# EasyEDA Pro project balanceladder_2026-06-09.epro

# Schematic Schematic1
Board Name: Board1; Create Date: 2026-06-08; Page Name: P1; Project Name: balance ladder; Schematic Name: Schematic1; Update Date: 2026-06-08; Company: 嘉立创EDA; Page Size: A4; Version: V1.0
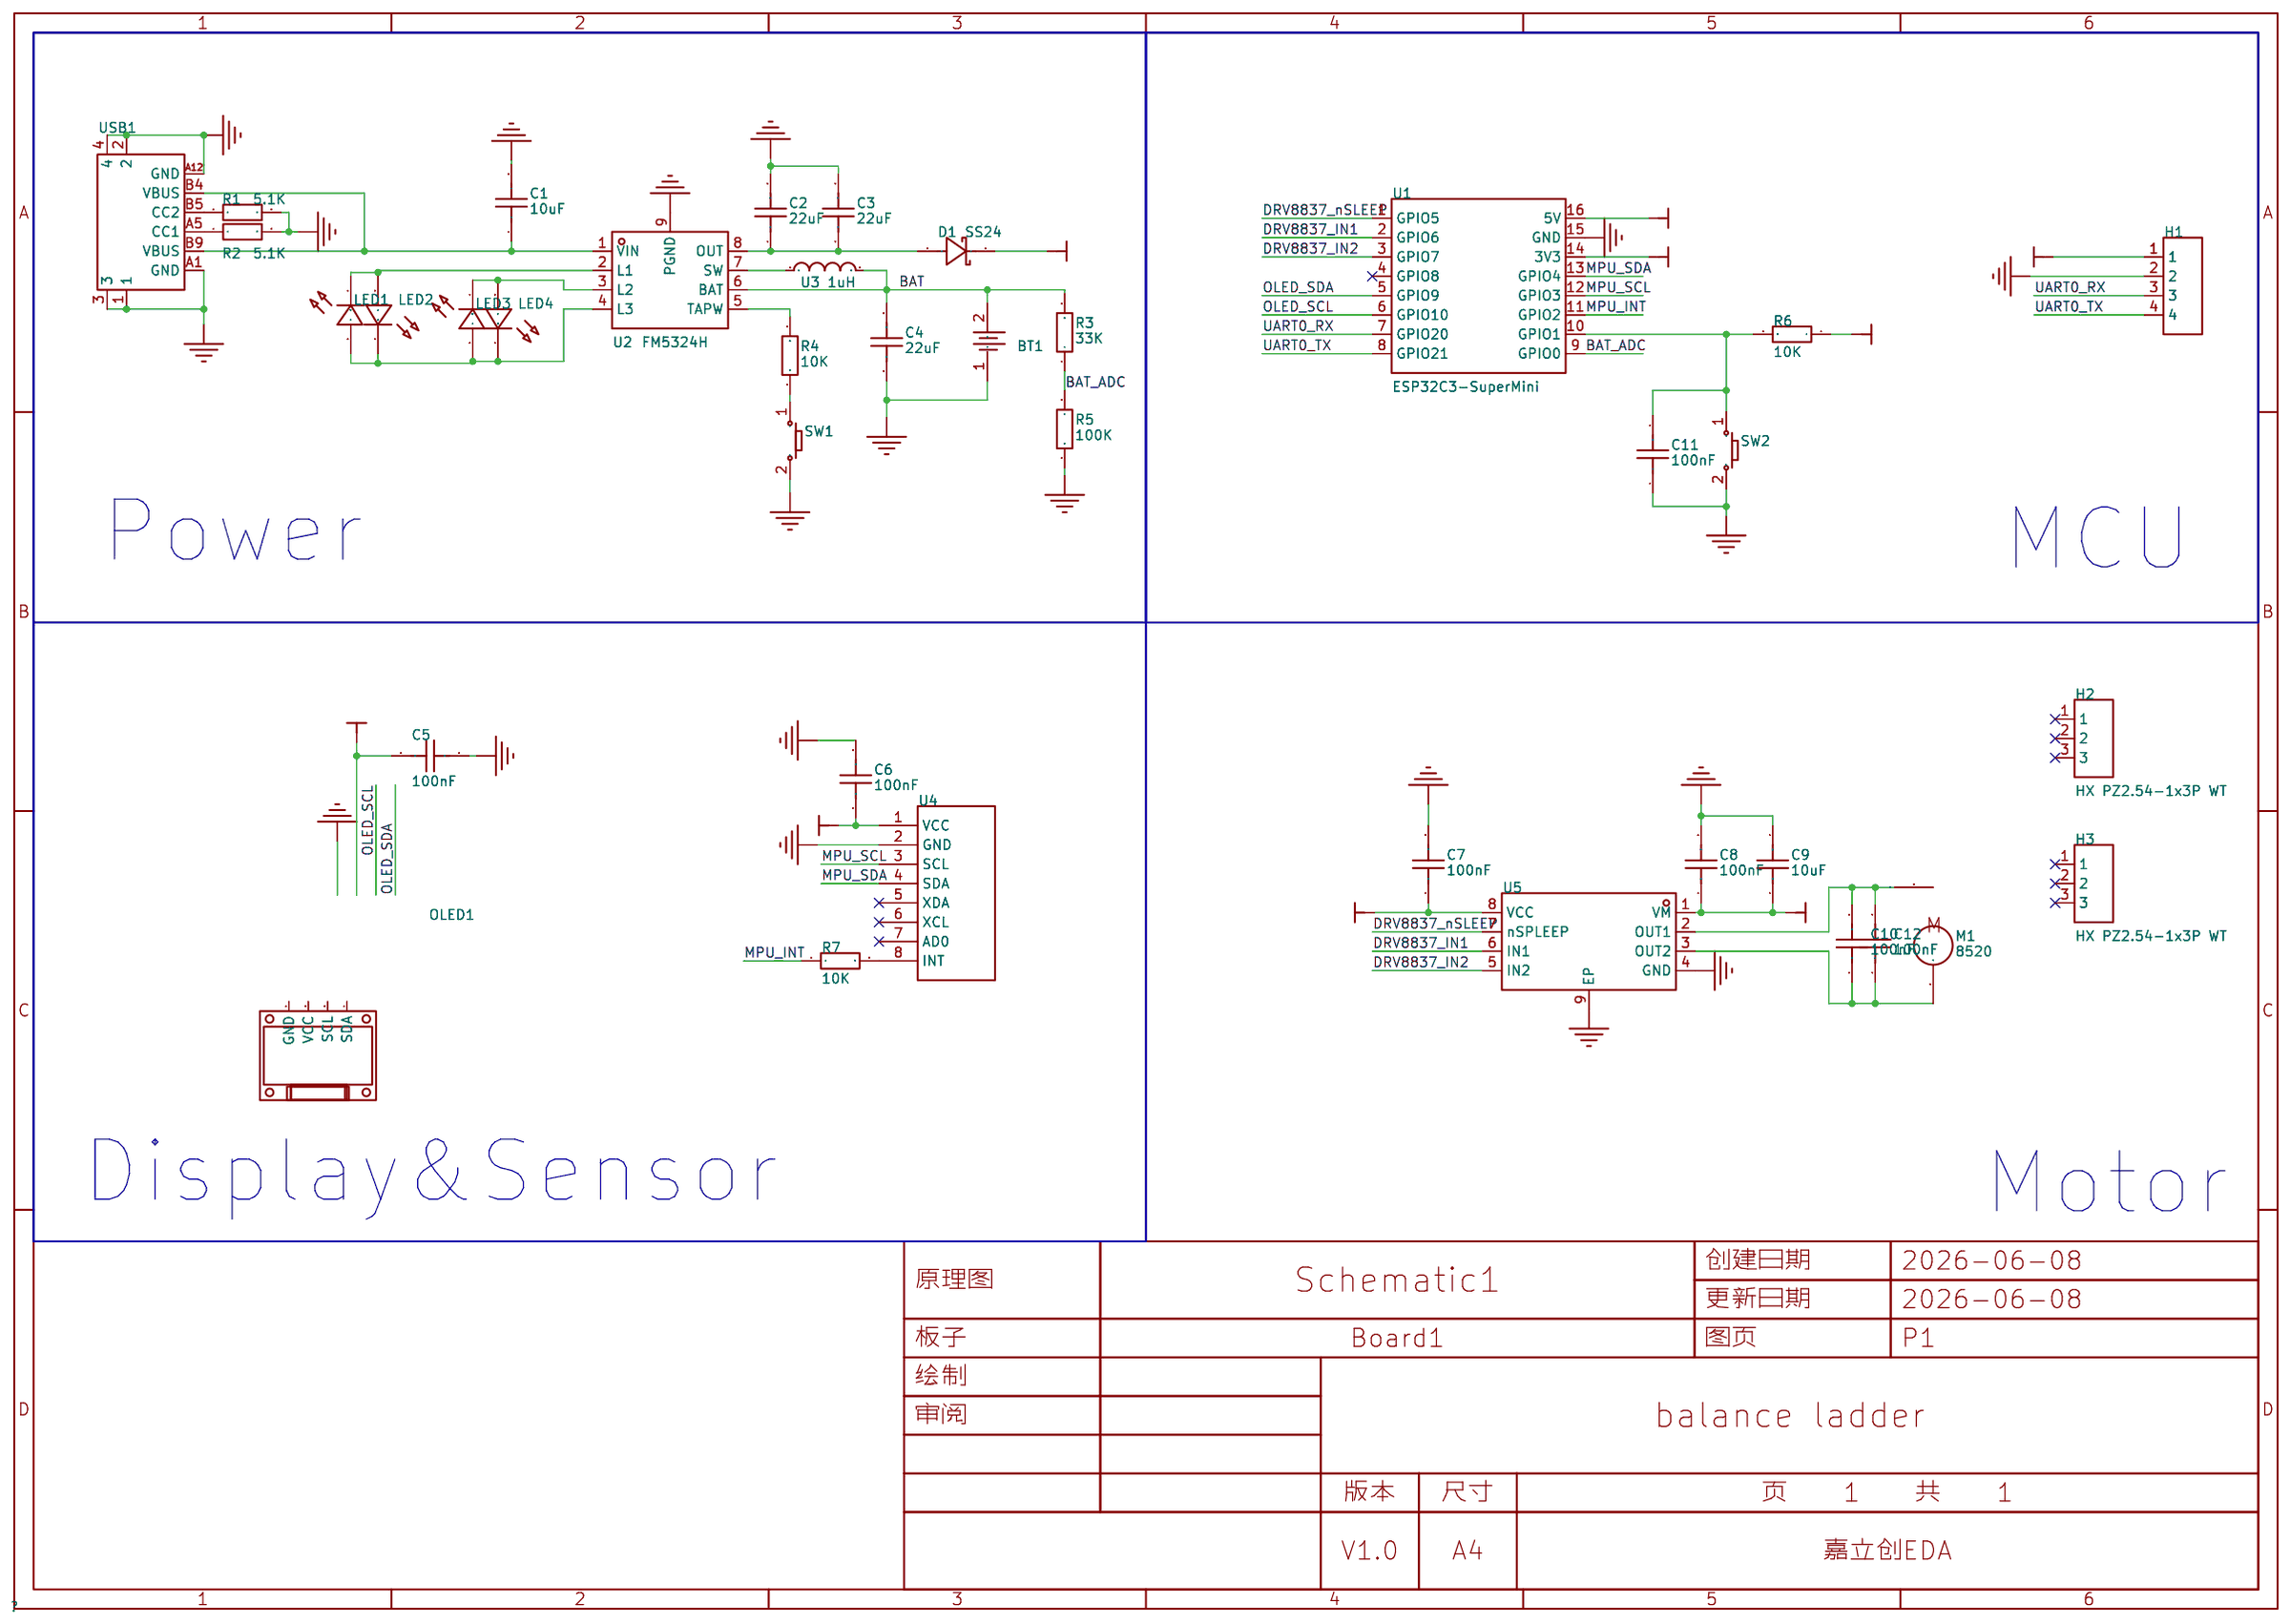
[diagram p0: schematic sheet]

## Parts
BT1  BH-18650-B1BA002  [BATTERY-SMD_18650-1S-L77.1-W20.7-1]
C1  10uF  [C0603]
C2  22uF  [C0603]
C3  22uF  [C0603]
C4  22uF  [C0603]
C5  100nF  [C0402]
C6  100nF  [C0402]
C7  100nF  [C0402]
C8  100nF  [C0402]
C9  10uF  [C0603]
C10  100nF  [C0402]
C11  100nF  [C0402]
C12  100nF  [C0402]
D1  SS24  [SMA_L4.3-W2.6-LS5.0-FD]
H1  HX PZ2.54-1x4P WT  [CONN-SMD_HX-PZ2.54-1X4P-WT]
H2  HX PZ2.54-1x3P WT  [HDR-SMD_3P-P2.54-H-M_KH-2.54PH-1X3P-L13.5-WT]
H3  HX PZ2.54-1x3P WT  [HDR-SMD_3P-P2.54-H-M_KH-2.54PH-1X3P-L13.5-WT]
LED1  -  [LED_0603]
LED2  -  [LED_0603]
LED3  -  [LED_0603]
LED4  -  [LED_0603]
M1  8520  [8520]
OLED1  -  [0.96OLED_4P]
R1  5.1K  [R0603]
R2  5.1K  [R0603]
R3  33K  [R0603]
R4  10K  [R0603]
R5  100K  [R0603]
R6  10K  [R0603]
R7  10K  [R0402]
SW1  -  [Key_SMD_3x4x2]
SW2  -  [Key_SMD_3x4x2]
U1  ESP32C3-SuperMini  [COMM-SMD_16P-L22.5-W18.0-P2.54-TL]
U2  FM5324H  [ESOP-8_L4.9-W3.9-P1.27-LS6.0-BL-EP3.1]
U3  1uH  [IND-SMD_L2.5-W2.0-VLS252012CX-150M]
U4  -  [GY521]
U5  DRV8837DSGR  [WSON-8_L2.0-W2.0-P0.50-TL-EP]
USB1  HYCW574-USBC06-650B  [USB-C-SMD_HYCW574-USBC06-650B]

## Library data of the parts
BT1 = BH-18650-B1BA002: BHAu SMT/适用电池18650平头电芯//电池底座/ 卧式自动化生产贴片电池盒/符合耐高温SMT回流焊工艺/材质：PA46/SUS304 T=0.35mm/镀金/; LCSC Part Name: MYOUNG(美阳)电池盒 BHAu 适用电池18650平头电芯、电池底座、卧式自动化生产贴片电池盒、SMT 180° TYPE; Supplier Part: C2988620; Manufacturer: MYOUNG(美阳); JLCPCB Part Class: 扩展库; Datasheet: https://item.szlcsc.com/datasheet/BH-18650-B1BA002/3446919.html; Supplier: LCSC; Type: 电池盒; Operating Temperature: -25~85℃; Contact material: 磷青铜; Contact coating: 镀金; Applicable battery specifications: 18650
C1-C4 C9 = CAP_0603: Supplier Footprint: 0603
C5-C8 C10-C12 = CL05B104KO5NNNC: 容值:100nF;精度:±10%;额定电压:16V;温度系数:X7R;; LCSC Part Name: 100nF ±10% 16V; Supplier Part: C1525; Manufacturer: SAMSUNG(三星); Supplier Footprint: 0402; JLCPCB Part Class: Basic Part; Datasheet: https://item.szlcsc.com/datasheet/CL05B104KO5NNNC/1877.html; Supplier: LCSC; Tolerance: ±10%; Voltage Rating: 16V; Temperature Coefficient: X7R
D1 = SS24_C7420362: 二极管配置:独立式;正向压降(Vf):550mV@2A;直流反向耐压(Vr):40V;整流电流:2A;; LCSC Part Name: 电压:40V 电流:2A; Supplier Part: C7420362; Manufacturer: R+O(宏嘉诚); Supplier Footprint: SMA(DO-214AC); JLCPCB Part Class: Extended Part; Datasheet: https://item.szlcsc.com/datasheet/SS24/8397184.html; Supplier: LCSC; Diode Configuration: 独立式; Voltage - Forward(Vf@If): 550mV@2A; Voltage - DC Reverse(Vr): 40V; Current - Rectified: 2A; Reverse Leakage Current (Ir): 200uA@40V; Operating Junction Temperature Range: -55℃~+150℃; Non-Repetitive Peak Forward Surge Current: 50A
H1 = HX PZ2.54-1x4P WT: 插针结构:1x4P;间距:2.54mm;行距:-;圆针/方针:方针;安装方式:卧贴;排数:单排;总PIN位数:4P;额定电流:3A;额定电压:1kV;配合针长度:6mm;塑高:2.5mm;端接针长度:-;触头材质:黄铜;触头镀层:金;工作温度:-40℃~+105℃;颜色:黑色;; LCSC Part Name: 配套排母：HX PM2.54-1x4P系列 1x4P 间距:2.54mm 方针 卧贴; Supplier Part: C46061677; Manufacturer: hanxia(韩下); Supplier Footprint: SMD,P=2.54mm,卧贴; JLCPCB Part Class: Extended Part; Datasheet: https://item.szlcsc.com/datasheet/HX%2520PZ2.54-1x4P%2520WT/48170537.html; Supplier: LCSC; Pin Structure: 1x4P; Pitch: 2.54mm; Circluar Pins/Square Pins: 方针; Mounting Type: 卧贴; Number of Rows: 单排; Number of Pins: 4P; Current Rating: 3A; Voltage Rating (Max): 1kV; Length of Mating Pin: 6mm; Insulation Height: 2.5mm; Contact Material: 黄铜; Contact Plating: 金; Operating Temperature: -40℃~+105℃; Color: 黑色
H2 H3 = HX PZ2.54-1x3P WT: 插针结构:1x3P;间距:2.54mm;行距:-;圆针/方针:方针;安装方式:卧贴;排数:单排;总PIN位数:3P;额定电流:3A;额定电压:1kV;配合针长度:6mm;塑高:2.5mm;端接针长度:-;触头材质:黄铜;触头镀层:金;工作温度:-40℃~+105℃;颜色:黑色;; LCSC Part Name: 配套排母：HX PM2.54-1x3P系列 1x3P 间距:2.54mm 方针 卧贴; Supplier Part: C46061676; Manufacturer: hanxia(韩下); Supplier Footprint: SMD,P=2.54mm,卧贴; JLCPCB Part Class: Extended Part; Datasheet: https://item.szlcsc.com/datasheet/HX%2520PZ2.54-1x3P%2520WT/48170536.html; Supplier: LCSC; Pin Structure: 1x3P; Pitch: 2.54mm; Circluar Pins/Square Pins: 方针; Mounting Type: 卧贴; Number of Rows: 单排; Number of Pins: 3P; Current Rating: 3A; Voltage Rating (Max): 1kV; Length of Mating Pin: 6mm; Insulation Height: 2.5mm; Contact Material: 黄铜; Contact Plating: 金; Operating Temperature: -40℃~+105℃; Color: 黑色
LED1-LED4 = LED_0603-G: Supplier Footprint: 0603
M1 = 8520: Published: 24-Mar-1999; LatestRevisionDate: 17-Jul-2002; LatestRevisionNote: Re-released for DXP Platform.; PackageReference: RB5-10.5; Publisher: Altium Limited; PackageDescription: Capacitor (Radial); 2 Leads
OLED1 = 0.96OLED模块_4P: Supplier Footprint: 插件
R1-R6 = Res_0603: Supplier Footprint: 0603
R7 = Res_0402: Supplier Footprint: 0402
SW1 SW2 = Key_SMD_3x4x2: Supplier Footprint: SMD
U1 = ESP32C3-SuperMini: Supplier Part: C9900147397; Supplier Footprint: SMD-16P; JLCPCB Part Class: Extended Part; Supplier: LCSC
U2 = FM5324H: LCSC Part Name: 停产; Supplier Part: C7420388; Manufacturer: FM(富满); Supplier Footprint: ESOP8L; JLCPCB Part Class: Extended Part; Supplier: LCSC
U3 = FTC252012S1R0MBCA: 电感值:1uH;精度:±20%;额定电流:4A;饱和电流(Isat):5.6A;类型:-;; LCSC Part Name: 1uH ±20% 5.6A; Supplier Part: C5832370; Manufacturer: cjiang(长江微电); Supplier Footprint: 1008; JLCPCB Part Class: Extended Part; Datasheet: https://item.szlcsc.com/datasheet/FTC252012S1R0MBCA/6763490.html; Supplier: LCSC; Tolerance: ±20%; Current Rating: 4A; Current - Saturation(Isat): 5.6A; DC Resistance(DCR): 35mΩ
U4 = GY521: MPU6050陀螺仪传感器模块
U5 = DRV8837DSGR: DRV8837 12V、1.8A H 桥电机驱动器; LCSC Part Name: 1.8A 有刷直流电机驱动芯片 7V; Supplier Part: C39159; Manufacturer: TI(德州仪器); Supplier Footprint: WSON-8-EP(2x2); JLCPCB Part Class: Extended Part; Datasheet: https://www.ti.com/cn/lit/gpn/drv8837; Supplier: LCSC; Technology: 是; Peak Current: 1.9A; Voltage - Supply: 1.8V~7V; RDS(on): 280mΩ; Quiescent Current(Iq): 120nA; Operating Temperature: -40℃~+85℃
USB1 = HYCW574-USBC06-650B: 连接器类型:Type-C;协议标准:USB 3.1;公母:母;安装方式:卧贴;触点数量:6P;端口数量:1;额定电流 - 电源:3A;工作温度:-25℃~+85℃;; LCSC Part Name: Type-C 母 卧贴; Supplier Part: C42400239; Manufacturer: HOAUC(华宇创); Supplier Footprint: SMD; JLCPCB Part Class: 扩展库; Datasheet: https://item.szlcsc.com/datasheet/HYCW574-USBC06-650B/44352772.html; Supplier: LCSC; Connector Type: Type-C; Protocol Standard: USB 3.1; Gender: 母; Mounting Type: 卧贴; Number of Contacts: 6P; Number of Ports: 1; Current Rating-Power: 3A; Connect-Disconnect Life: 5千次; Length: 6.5mm; Detection color: 黑色; Operating Temperature: -25℃~+85℃

## Nets
+5V: C8.1 C9.1 D1.2(K) U1.16(5V) U5.1(VM)
GND: BT1.1 C1.2 C2.2 C3.2 C4.1 C5.1 C6.2 C7.2 C8.2 C9.2 C11.1 H1.2 R1.2 R2.2 R5.1 SW1.2 SW2.2 U1.15(GND) U2.9(PGND) U4.2(GND) U5.4(GND) U5.9(EP) USB1.1 USB1.2 USB1.3 USB1.4 USB1.A1(GND) USB1.A12(GND)
VCC: C5.2 C6.1 C7.1 H1.1 R6.1 U1.14(3V3) U4.1(VCC) U5.8(VCC)
BAT: BT1.2 C4.2 R3.2 U2.6(BAT) U3.2
BAT_ADC: R3.1 R5.2 U1.9(GPIO0)
DRV8837_IN1: U1.2(GPIO6) U5.6(IN1)
DRV8837_IN2: U1.3(GPIO7) U5.5(IN2)
DRV8837_nSLEEP: U1.1(GPIO5) U5.7(nSPLEEP)
MPU_INT: R7.1 U1.11(GPIO2)
MPU_SCL: U1.12(GPIO3) U4.3(SCL)
MPU_SDA: U1.13(GPIO4) U4.4(SDA)
OLED_SCL: U1.6(GPIO10)
OLED_SDA: U1.5(GPIO9)
UART0_RX: H1.3 U1.7(GPIO20)
UART0_TX: H1.4 U1.8(GPIO21)
$1N883: R4.2 U2.5(TAPW)
$1N886: U2.7(SW) U3.1
$1N887: C2.1 C3.1 D1.1(A) U2.8(OUT)
$1N1154: C10.2 C12.2 M1.2 U5.2(OUT1)
$1N1155: C10.1 C12.1 M1.1 U5.3(OUT2)
$1N1213: R7.2 U4.8(INT)
Net-(C1-1): C1.1 U2.1(VIN) USB1.B4(VBUS) USB1.B9(VBUS)
Net-(C11-2): C11.2 R6.2 SW2.1 U1.10(GPIO1)
Net-(LED1-1): LED1.1(C) LED2.2(A) U2.2(L1)
Net-(LED1-2): LED1.2(A) LED2.1(C) LED3.2(A) LED4.1(C) U2.4(L3)
Net-(LED3-1): LED3.1(C) LED4.2(A) U2.3(L2)
Net-(R1-1): R1.1 USB1.B5(CC2)
Net-(R2-1): R2.1 USB1.A5(CC1)
Net-(R4-1): R4.1 SW1.1

Not connected (* = marked no-connect by the designer): H2 1* 2* 3*; H3 1* 2* 3*; OLED1 1(GND) 2(VCC) 3(SCL) 4(SDA); U1 4(GPIO8)*; U4 5(XDA)* 6(XCL)* 7(AD0)*

## Notes on the sheet
- Power
- MCU
- Display&Sensor
- Motor

# Board PCB1
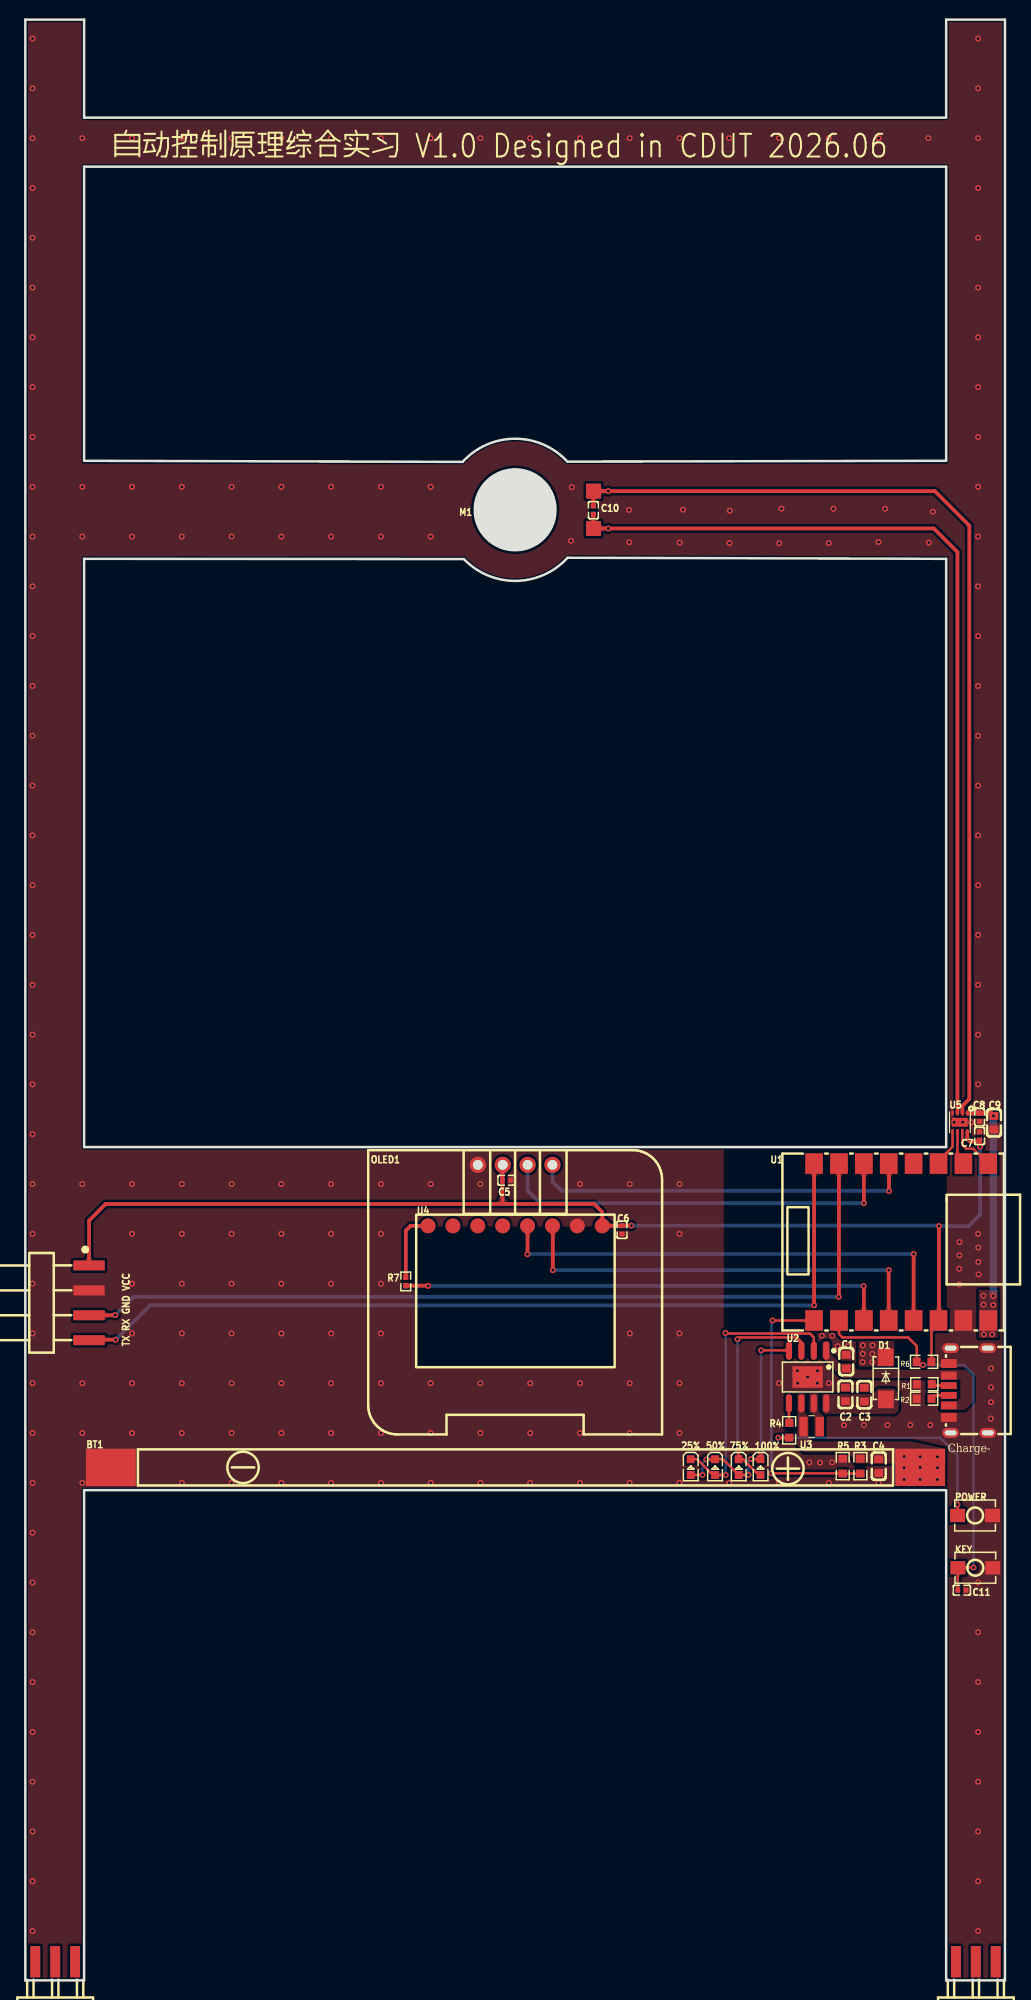
[diagram p1: board, top side]
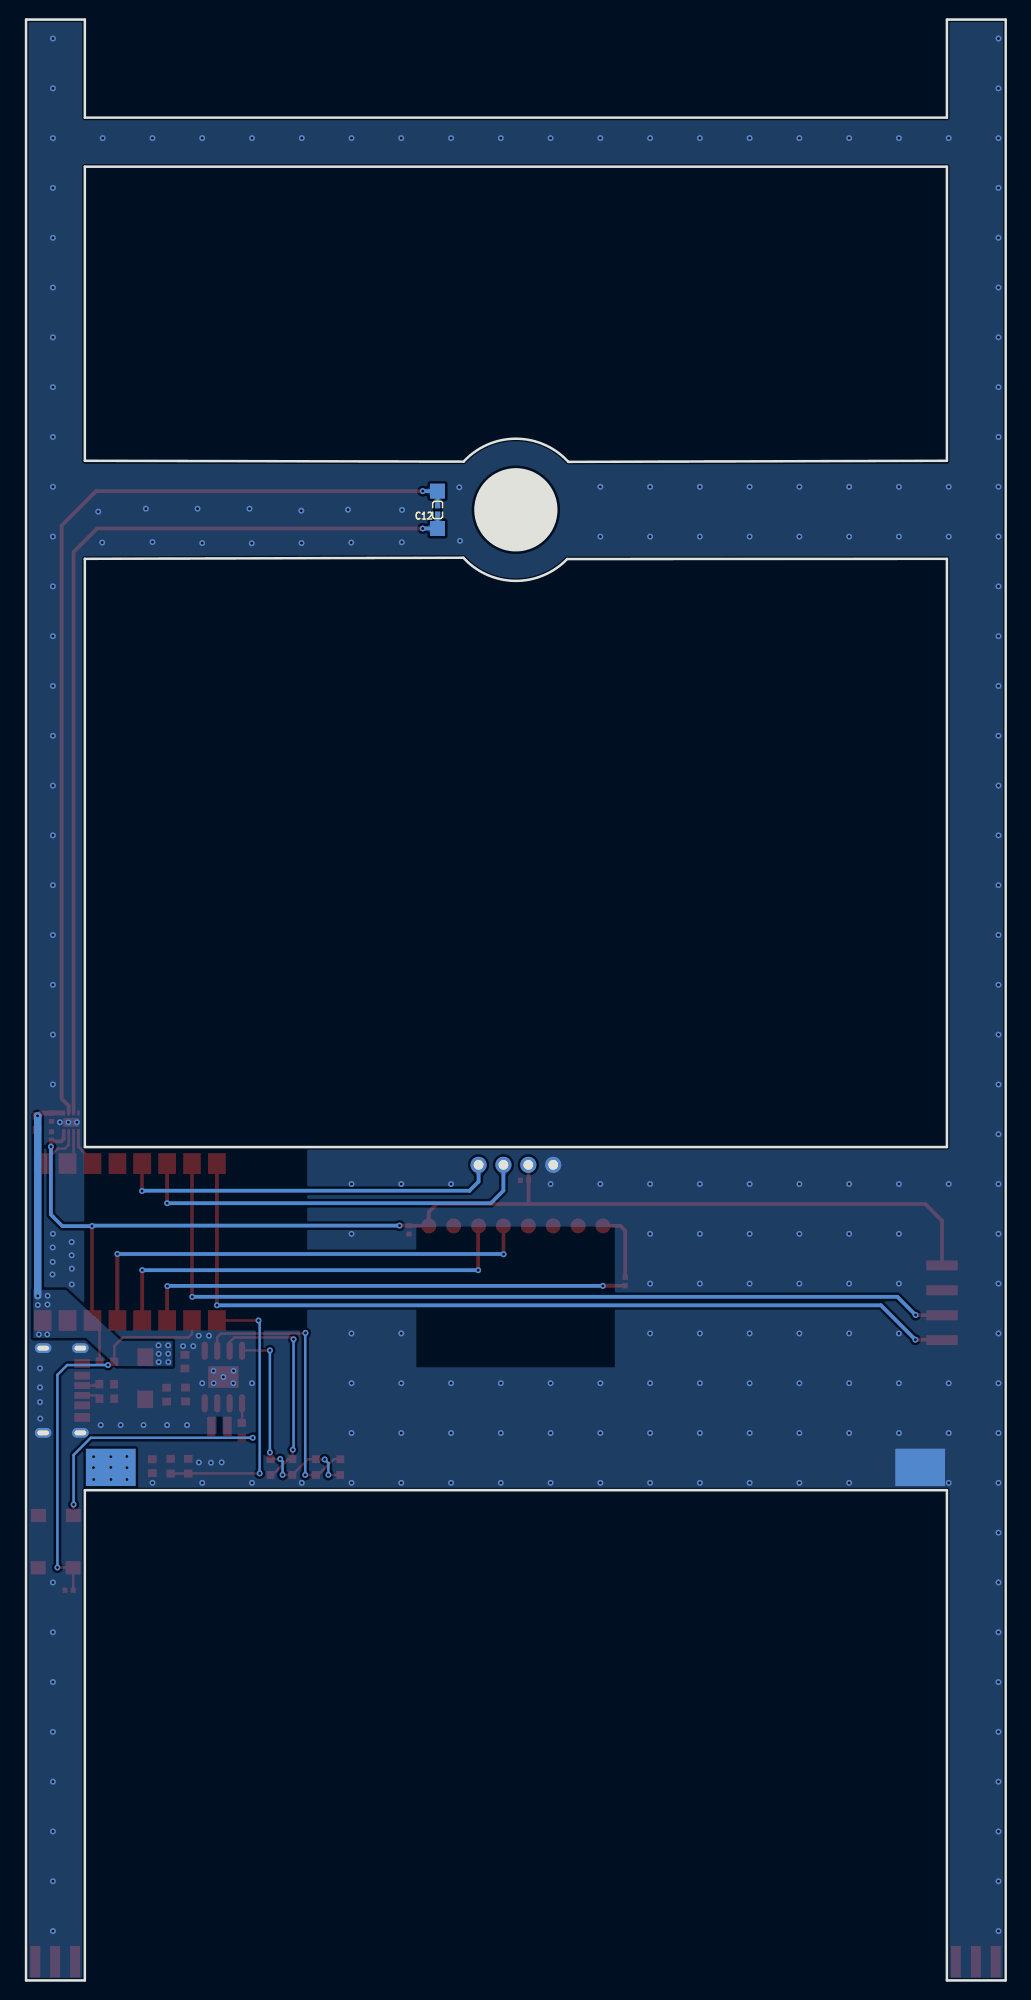
[diagram p2: board, bottom side, seen from below]

Outline 100 x 200 mm; copper layers: Top Layer, Bottom Layer. Coordinates in mm from the lower left corner of the outline.
Outline path: 0,200 0,0 6,0 6,50 94,50 94,0 100,0 100,200 94,200 94,190 6,190 6,200 0,200 ; 6,185 6,155 44.65,154.89 arc(49.98,157.25) 55.33,154.91 94,155 94,185 6,185 ; 6,145 6,85 94,85 94,145 55.35,145.11 arc(50.09,142.75) 44.77,144.98 6,145
Stack: Top Layer 0.035mm / Dielectric1 1.51mm FR4 er 4.5 / Bottom Layer 0.035mm

## Design rules (mm)
spacing copperThickness1oz (default): track to track 0.102, other pairs 0 to 0.3
spacing copperThickness2oz: track to track 0.203, other pairs 0.152 to 0.3
track width copperThickness1oz (default): min 0.127, default 0.254, max 2.54
track width copperThickness2oz: min 0.203, default 0.254, max 2.54
differential pair differentialPair (default): width min 0.127, default 0.254, max 2.54; gap min 0.152, default 0.152
net GND uses copperRegion_copperThickness1oz
pour e400 uses copperRegion_copperThickness2oz, copperThickness2oz

## Placement (name value [footprint] x y rotation side)
25%  -  [LED_0603]  67.93 52.31 270 top
50%  -  [LED_0603]  70.41 52.31 270 top
75%  -  [LED_0603]  72.83 52.31 270 top
100%  -  [LED_0603]  75.06 52.31 270 top
BT1  BH-18650-B1BA002  [BATTERY-SMD_18650-1S-L77.1-W20.7-1]  50.04 54.1 270 top
C1  10uF  [C0603]  83.79 63.12 90 top
C2  22uF  [C0603]  83.72 59.77 90 top
C3  22uF  [C0603]  85.65 59.74 90 top
C4  22uF  [C0603]  87.12 52.45 90 top
C5  100nF  [C0402]  49.12 81.61 180 top
C6  100nF  [C0402]  60.91 76.56 270 top
C7  100nF  [C0402]  97.41 86.13 90 top
C8  100nF  [C0402]  97.41 88.04 270 top
C9  10uF  [C0603]  98.88 87.48 270 top
C10  100nF  [C0402]  57.99 149.96 90 top
C11  100nF  [C0402]  95.61 39.8 180 top
C12  100nF  [C0402]  57.99 149.99 90 bottom
Charge-  HYCW574-USBC06-650B  [USB-C-SMD_HYCW574-USBC06-650B]  96.27 60.17 90 top
D1  SS24  [SMA_L4.3-W2.6-LS5.0-FD]  87.83 61.42 90 top
H2  HX PZ2.54-1x3P WT  [HDR-SMD_3P-P2.54-H-M_KH-2.54PH-1X3P-L13.5-WT]  3.05 1.91 0 top
H3  HX PZ2.54-1x3P WT  [HDR-SMD_3P-P2.54-H-M_KH-2.54PH-1X3P-L13.5-WT]  97.03 1.91 0 top
KEY  -  [Key_SMD_3x4x2]  96.98 42.09 0 top
M1  -  [8520]  50 150 90 top
OLED1  -  [0.96OLED_4P]  50 83.19 0 top
POWER  -  [Key_SMD_3x4x2]  96.95 47.42 0 top
R1  5.1K  [R0603]  91.77 60.81 180 top
R2  5.1K  [R0603]  91.75 59.33 180 top
R3  33K  [R0603]  85.24 52.45 90 top
R4  10K  [R0603]  77.98 56.11 90 top
R5  100K  [R0603]  83.44 52.45 270 top
R6  10K  [R0603]  91.75 63.09 180 top
R7  10K  [R0402]  38.84 71.3 90 top
TX RX GND VCC  HX PZ2.54-1x4P WT  [CONN-SMD_HX-PZ2.54-1X4P-WT]  6.5 69.11 270 top
U1  ESP32C3-SuperMini  [COMM-SMD_16P-L22.5-W18.0-P2.54-TL]  89.41 75.31 270 top
U2  FM5324H  [ESOP-8_L4.9-W3.9-P1.27-LS6.0-BL-EP3.1]  79.86 61.54 180 top
U3  1uH  [IND-SMD_L2.5-W2.0-VLS252012CX-150M]  80.26 56.49 180 top
U4  -  [GY521]  50 69.98 270 top
U5  DRV8837DSGR  [WSON-8_L2.0-W2.0-P0.50-TL-EP]  95.4 87.53 270 top

## Footprints (pads in the part's own frame, mm; a bottom-side part is the same pattern mirrored in y, then rotated)
0.96OLED_4P
  round 1.65 hole 1: 1(-3.81,-0.002) 2(-1.27,0.002) 3(1.27,0.002) 4(3.81,0.002)
8520
  rect 1.524x1.524 smd: 1(-1.905,-8.001) 2(1.905,-8.001)
  rect 1.524x1.524 smd far side: 1(-1.905,-8.001) 2(1.905,-8.001)
BATTERY-SMD_18650-1S-L77.1-W20.7-1
  rect 3.8x5.08 smd: 1(1.778,-41.313) 2(1.778,41.313)
  rect 3.8x5.08 smd far side: 1(1.778,-41.313) 2(1.778,41.313)
C0402
  rect 0.5x0.54 smd: 1(-0.42,0) 2(0.42,0)
C0603
  rect 0.8x0.9 smd: 1(-0.7,0) 2(0.7,0)
COMM-SMD_16P-L22.5-W18.0-P2.54-TL
  rect 2.102x1.802 smd: 1(-8.001,8.89) 2(-8.001,6.35) 3(-8.001,3.81) 4(-8.001,1.27) 5(-8.001,-1.27) 6(-8.001,-3.81) 7(-8.001,-6.35) 8(-8.001,-8.89) 9(8.001,-8.89) 10(8.001,-6.35) 11(8.001,-3.81) 12(8.001,-1.27) 13(8.001,1.27) 14(8.001,3.81) 15(8.001,6.35) 16(8.001,8.89)
CONN-SMD_HX-PZ2.54-1X4P-WT
  rect 1.02x3.2 smd: 1(-3.81,0) 2(-1.27,0) 3(1.27,0) 4(3.81,0)
ESOP-8_L4.9-W3.9-P1.27-LS6.0-BL-EP3.1
  oval 0.63x1.865 smd: 1(-1.905,-2.683) 2(-0.635,-2.683) 3(0.635,-2.683) 4(1.905,-2.683) 5(1.905,2.683) 6(0.635,2.683) 7(-0.635,2.683) 8(-1.905,2.683)
  rect 3.1x2.2 smd: 9(0,0)
GY521
  round 1.524 smd: 1(-6.985,8.89) 2(-6.985,6.35) 3(-6.985,3.81) 4(-6.985,1.27) 5(-6.985,-1.27) 6(-6.985,-3.81) 7(-6.985,-6.35) 8(-6.985,-8.89)
HDR-SMD_3P-P2.54-H-M_KH-2.54PH-1X3P-L13.5-WT
  rect 1.02x3.2 smd: 1(-2.032,0) 2(0,0) 3(2.032,0)
IND-SMD_L2.5-W2.0-VLS252012CX-150M
  rect 0.85x2 smd: 1(-0.83,0) 2(0.83,0)
Key_SMD_3x4x2
  rect 1.53x1.36 smd: 1(-1.781,0) 2(1.781,0)
LED_0603
  rect 0.8x0.8 smd: 1(-0.851,-0.01) 2(0.75,-0.005)
R0402
  rect 0.566x0.54 smd: 1(-0.433,0) 2(0.433,0)
R0603
  rect 0.806x0.864 smd: 1(-0.753,0) 2(0.753,0)
SMA_L4.3-W2.6-LS5.0-FD
  rect 1.8x1.62 smd: 1(-2.15,-0.009) 2(2.15,0.009)
USB-C-SMD_HYCW574-USBC06-650B
  oval 1x1.7 hole 0.5x1.2: 1(-4.32,1.81) 2(4.32,1.81) 3(-4.32,-1.99) 4(4.32,-1.99)
  rect 0.9x1.6 smd: A1(-2.752,1.99) A12(2.748,1.99)
  rect 0.7x1.6 smd: A5(-0.502,1.99) B5(0.498,1.99)
  rect 0.8x1.6 smd: B4(1.518,1.99) B9(-1.522,1.99)
WSON-8_L2.0-W2.0-P0.50-TL-EP
  rect 0.521x0.25 smd: 1(-0.95,0.75) 2(-0.95,0.25) 3(-0.95,-0.25) 4(-0.95,-0.75) 5(0.95,-0.75) 6(0.95,-0.25) 7(0.95,0.25) 8(0.95,0.75)
  rect 0.9x1.6 smd: 9(0,0)

## Nets
+5V: C8.1 C9.1 D1.2 U1.16 U5.1
GND: BT1.1 C1.2 C2.2 C3.2 C4.1 C5.1 C6.2 C7.2 C8.2 C9.2 C11.1 Charge-.1 Charge-.2 Charge-.3 Charge-.4 Charge-.A1 Charge-.A12 KEY.2 OLED1.1 POWER.2 R1.2 R2.2 R5.1 TX RX GND VCC.2 U1.15 U2.9 U4.2 U5.4 U5.9
VCC: C5.2 C6.1 C7.1 OLED1.2 R6.1 TX RX GND VCC.1 U1.14 U4.1 U5.8
BAT: BT1.2 C4.2 R3.2 U2.6 U3.2
BAT_ADC: R3.1 R5.2 U1.9
DRV8837_IN1: U1.2 U5.6
DRV8837_IN2: U1.3 U5.5
DRV8837_nSLEEP: U1.1 U5.7
MPU_INT: R7.1 U1.11
MPU_SCL: U1.12 U4.3
MPU_SDA: U1.13 U4.4
OLED_SCL: OLED1.3 U1.6
OLED_SDA: OLED1.4 U1.5
UART0_RX: TX RX GND VCC.3 U1.7
UART0_TX: TX RX GND VCC.4 U1.8
$1N882: POWER.1 R4.1
$1N883: R4.2 U2.5
$1N886: U2.7 U3.1
$1N887: C2.1 C3.1 D1.1 U2.8
$1N889: C1.1 Charge-.B4 Charge-.B9 U2.1
$1N890: 75%.1 100%.2 U2.3
$1N893: 25%.2 50%.1 75%.2 100%.1 U2.4
$1N894: 25%.1 50%.2 U2.2
$1N1088: Charge-.B5 R1.1
$1N1120: Charge-.A5 R2.1
$1N1154: C10.2 C12.2 M1.2 U5.2
$1N1155: C10.1 C12.1 M1.1 U5.3
$1N1203: C11.2 KEY.1 R6.2 U1.10
$1N1213: R7.2 U4.8

Pads without a net: H2 1 2 3; H3 1 2 3; U1 4; U4 5 6 7

## Via types
v1: diameter 0.61, hole 0.305, Top Layer to Bottom Layer, 283 vias

## Routing (per net, layer and track width the routed paths; a pad name or vN(x,y) marks a point on that pad's centre or on a via; arc(x,y) is an arc through that point)
+5V: length 21.1
  Top Layer w0.508: v1(98.83,88.19) 98.56,88.46 C8.1 97.39,88.48 96.23,88.48
  Bottom Layer w0.762: v1(98.81,69.82) 98.81,88.16 v1(98.83,88.19)
  vias: v1(85.5,64.77) v1(85.49,63.92) v1(85.47,63.07) v1(86.48,64.77) v1(86.46,63.91) v1(86.46,63.07) v1(97.8,69.83) v1(97.82,68.94) v1(97.84,65.89) v1(98.69,65.89) v1(98.81,68.88)
GND:
  vias: v1(0.74,198.07) v1(0.74,192.99) v1(0.74,187.91) v1(0.74,182.83) v1(0.74,177.75) v1(0.74,172.67) v1(0.74,167.59) v1(0.74,162.51) v1(0.74,157.43) v1(0.74,152.35) v1(0.74,147.27) v1(0.74,142.19) v1(0.74,137.11) v1(0.74,132.03) v1(0.74,126.95) v1(0.74,121.87) v1(0.74,116.79) v1(0.74,111.71) v1(0.74,106.63) v1(0.74,101.55) v1(0.74,96.47) v1(0.74,91.39) v1(0.74,86.31) v1(0.74,81.23) v1(0.74,76.15) v1(0.74,71.07) v1(0.74,65.99) v1(0.74,60.91) v1(0.74,55.83) v1(0.74,50.75) v1(0.74,45.67) v1(0.74,40.59) v1(0.74,35.51) v1(0.74,30.43) v1(0.74,25.35) v1(0.74,20.27) v1(0.74,15.19) v1(0.74,10.11) v1(0.74,5.03) v1(5.82,187.91) v1(5.82,152.35) v1(5.82,147.27) v1(5.82,81.23) v1(5.82,60.91) v1(5.82,55.83) v1(5.82,50.75) v1(10.9,187.91) v1(10.9,152.35) v1(10.9,147.27) v1(10.9,81.23) v1(10.9,76.15) v1(10.9,71.07) v1(10.9,65.99) v1(10.9,60.91) v1(10.9,55.83) v1(15.98,187.91) v1(15.98,152.35) v1(15.98,147.27) v1(15.98,81.23) v1(15.98,76.15) v1(15.98,71.07) v1(15.98,65.99) v1(15.98,60.91) v1(15.98,55.83) v1(15.98,50.75) v1(21.06,187.91) v1(21.06,152.35) v1(21.06,147.27) v1(21.06,81.23) v1(21.06,76.15) v1(21.06,71.07) v1(21.06,65.99) v1(21.06,60.91) v1(21.06,55.83) v1(21.06,50.75) v1(26.14,187.91) v1(26.14,152.35) v1(26.14,147.27) v1(26.14,81.23) v1(26.14,76.15) v1(26.14,71.07) v1(26.14,65.99) v1(26.14,60.91) v1(26.14,55.83) v1(26.14,50.75) v1(31.22,187.91) v1(31.22,152.35) v1(31.22,147.27) v1(31.22,81.23) v1(31.22,76.15) v1(31.22,71.07) v1(31.22,65.99) v1(31.22,60.91) v1(31.22,55.83) v1(31.22,50.75) v1(36.3,187.91) v1(36.3,152.35) v1(36.3,147.27) v1(36.3,81.23) v1(36.3,76.15) v1(36.3,71.07) v1(36.3,65.99) v1(36.3,60.91) v1(36.3,55.83) v1(36.3,50.75) v1(41.38,187.91) v1(41.38,152.35) v1(41.38,147.27) v1(41.38,81.23) v1(41.38,60.91) v1(41.38,55.83) v1(41.38,50.75) v1(46.46,187.91) v1(46.46,81.23) v1(46.46,60.91) v1(46.46,55.83) v1(46.46,50.75) v1(51.54,187.91) v1(51.54,60.91) v1(51.54,55.83) v1(51.54,50.75) v1(55.7,146.84) v1(55.78,152.3) v1(56.62,187.91) v1(56.62,81.23) v1(56.62,60.91) v1(56.62,55.83) v1(56.62,50.75) v1(61.62,149.99) v1(61.65,146.69) v1(61.7,187.91) v1(61.7,81.23) v1(61.7,65.99) v1(61.7,60.91) v1(61.7,55.83) v1(61.7,50.75) v1(66.78,187.91) v1(66.8,146.66) v1(66.78,81.23) v1(66.78,76.15) v1(66.78,65.99) v1(66.78,60.91) v1(66.78,55.83) v1(66.78,50.75) v1(67.13,150.01) v1(71.86,187.91) v1(71.91,149.91) v1(71.88,146.61) v1(71.86,50.75) v1(76.94,187.91) v1(76.94,60.91) v1(76.94,50.75) v1(76.96,146.58) v1(77.19,150.11) v1(78.82,62.18) v1(78.84,60.91) v1(79.86,61.54) v1(80.04,52.83) v1(80.85,60.91) v1(80.87,62.18) v1(81.13,52.81) v1(81.33,65.76) v1(82.02,187.91) v1(82.02,146.61) v1(82.02,60.91) v1(82.02,50.75) v1(82.38,65.76) v1(82.36,52.83) v1(82.5,150.11) v1(82.93,64.69) v1(83.57,56.64) v1(83.97,64.69) v1(85.61,56.64) v1(87.1,187.91) v1(87.1,146.71) v1(87.1,50.75) v1(87.77,150.11) v1(88.01,56.64) v1(90.34,56.64) v1(92.18,187.91) v1(92.23,146.66) v1(92.38,56.64) v1(92.63,149.81) v1(94.82,87.53) v1(95.35,75.31) v1(95.35,73.96) v1(95.33,72.59) v1(95.33,70.99) v1(95.68,87.53) v1(96.55,87.53) v1(97.26,198.07) v1(97.26,192.99) v1(97.26,187.91) v1(97.26,182.83) v1(97.26,177.75) v1(97.26,172.67) v1(97.26,167.59) v1(97.26,162.51) v1(97.26,157.43) v1(97.26,152.35) v1(97.26,147.27) v1(97.26,142.19) v1(97.26,137.11) v1(97.26,132.03) v1(97.26,126.95) v1(97.26,121.87) v1(97.26,116.79) v1(97.26,111.71) v1(97.26,106.63) v1(97.26,101.55) v1(97.26,96.47) v1(97.26,91.39) v1(97.26,76.15) v1(97.28,74.75) v1(97.28,73.29) v1(97.31,72.01) v1(97.26,40.59) v1(97.26,35.51) v1(97.26,30.43) v1(97.26,25.35) v1(97.26,20.27) v1(97.26,15.19) v1(97.26,10.11) v1(97.26,5.03) v1(98.58,62.43) v1(98.58,60.49) v1(98.58,58.98) v1(98.55,57.3)
VCC: length 126.5
  Top Layer w0.254: U1.14 92.5,66.59 R6.1
  Top Layer w0.381: U5.8 96.15,85.84 96.42,85.57 97.27,85.57 C7.1 97.46,85.66 v1(97.46,85.04) ; U1.14 93.27,67.36 v1(93.27,76.94) ; 48.7,79.2 C5.2 48.7,83.16 OLED1.2 ; 48.7,79.2 58.06,79.2 58.89,78.37 U4.1 58.9,76.98 C6.1 60.92,76.99 v1(61.87,76.99) ; 48.7,79.2 8.2,79.2 6.5,77.5 TX RX GND VCC.1
  Bottom Layer w0.381: v1(97.46,85.04) 97.46,78.1 96.29,76.94 v1(93.27,76.94) 93.22,76.99 v1(61.87,76.99)
BAT:
  vias: v1(89.71,53.44) v1(89.71,52.3) v1(89.71,51.09) v1(91.34,51.09) v1(91.35,53.41) v1(91.35,52.32) v1(93.11,53.41) v1(93.12,52.3) v1(93.1,51.09)
BAT_ADC: length 29
  Top Layer w0.254: U1.9 v1(76.28,67.31) ; v1(76.15,51.71) 83.42,51.71 R5.2 R3.1
  Bottom Layer w0.254: v1(76.28,67.31) 76.16,67.19 76.16,51.72 v1(76.15,51.71)
DRV8837_IN1: length 3.5
  Top Layer w0.254: U1.2 95.15,83.92 U5.6
DRV8837_IN2: length 3.9
  Top Layer w0.254: U1.3 93.22,83.59 94.65,85.03 U5.5
DRV8837_NSLEEP: length 1.4
  Top Layer w0.254: 95.65,86.58 95.65,85.22
DRV8837_nSLEEP: length 3.4
  Top Layer w0.254: 95.65,85.22 96.04,84.84 96.77,84.84 U1.1
MPU_INT: length 50.3
  Top Layer w0.381: v1(41.12,70.84) 41.1,70.87 R7.1 ; v1(85.57,70.81) 85.6,70.79 U1.11
  Bottom Layer w0.381: v1(85.57,70.81) 85.55,70.84 v1(41.12,70.84)
MPU_SCL: length 44
  Top Layer w0.381: U4.3 53.85,76.92 v1(53.85,72.44) ; U1.12 v1(88.14,72.44)
  Bottom Layer w0.381: v1(88.14,72.44) v1(53.85,72.44)
MPU_SDA: length 49.1
  Top Layer w0.381: U4.4 51.27,74.08 v1(51.26,74.07) ; U1.13 v1(90.68,74.09)
  Bottom Layer w0.381: v1(51.26,74.07) 51.28,74.09 v1(90.68,74.09)
OLED_SCL: length 41.5
  Top Layer w0.381: U1.6 v1(85.6,79.27)
  Bottom Layer w0.381: OLED1.3 51.27,80.56 52.55,79.27 v1(85.6,79.27)
OLED_SDA: length 39.3
  Top Layer w0.381: v1(88.16,80.52) 88.16,83.29 U1.5
  Bottom Layer w0.381: OLED1.4 53.81,81.47 54.74,80.54 88.14,80.54 v1(88.16,80.52)
UART0_RX: length 90.9
  Top Layer w0.381: v1(9.19,67.87) 9.17,67.84 TX RX GND VCC.3 ; v1(83.03,69.72) 83.06,69.75 U1.7
  Bottom Layer w0.381: v1(9.19,67.87) 11.05,69.72 v1(83.03,69.72)
UART0_TX: length 89.9
  Top Layer w0.381: TX RX GND VCC.4 6.55,65.35 v1(9.22,65.35) ; U1.8 v1(80.52,68.86)
  Bottom Layer w0.381: v1(9.22,65.35) 12.73,68.86 v1(80.52,68.86)
$1N882: length 26.3
  Top Layer w0.254: v1(76.86,55.35) 77.97,55.35 R4.1 ; POWER.1 95.17,48.52 v1(95.15,48.54)
  Bottom Layer w0.254: v1(76.86,55.35) 93.4,55.35 95.15,53.59 v1(95.15,48.54)
$1N883: length 2
  Top Layer w0.254: R4.2 77.95,56.89 U2.5
$1N890: length 22.9
  Top Layer w0.254: U2.3 79.22,65.1 78.74,65.58 72.88,65.58 v1(72.69,65.4) ; 100%.2 74.86,51.56 73.26,53.16 75%.1 72.82,54.08 v1(72.77,54.13)
  Bottom Layer w0.254: v1(72.77,54.13) 72.69,54.2 v1(72.69,65.4)
$1N893: length 24.6
  Top Layer w0.254: v1(74.06,53.18) 74.08,53.16 100%.1 75.11,53.22 v1(75.11,53.85) ; U2.4 77.92,64.26 v1(75.11,64.26) ; 25%.2 v1(69.14,51.56) ; v1(73.81,51.56) 73.81,51.56 75%.2 71.22,53.16 70.4,53.16 70.38,53.14 v1(69.52,53.14)
  Bottom Layer w0.254: v1(73.81,51.56) 73.81,52.93 v1(74.06,53.18) ; v1(69.14,51.56) 69.14,52.76 v1(69.52,53.14) ; v1(75.11,53.85) v1(75.11,64.26)
$1N894: length 29.3
  Top Layer w0.254: 25%.1 68.59,53.16 70.19,51.56 50%.2 v1(71.5,51.56) ; v1(71.48,66.04) 71.54,65.98 80.1,65.98 80.49,65.58 U2.2
  Bottom Layer w0.254: v1(71.48,66.04) 71.5,66.01 v1(71.5,51.56)
$1N1088: length 2
  Top Layer w0.254: 92.52,61.16 93.02,60.67 Charge-.B5
$1N1120: length 1.9
  Top Layer w0.254: 92.5,59.41 92.77,59.67 Charge-.A5
$1N1154: length 104.6
  Top Layer w0.381: C10.2 57.99,151.89 M1.2 v1(59.51,151.91) 92.85,151.91 96.37,148.39 96.37,89.92 95.65,89.2 U5.2
  Bottom Layer w0.381: v1(59.51,151.91) M1.2 57.99,151.89 C12.2
$1N1155: length 99.8
  Top Layer w0.381: C10.1 57.99,148.11 M1.1 v1(59.51,148.09) 92.75,148.09 95.15,145.69 U5.3
  Bottom Layer w0.381: v1(59.51,148.09) M1.1 58,149.55 C12.1
$1N1203: length 41.3
  Top Layer w0.254: v1(96.8,42.11) 95.22,42.11 KEY.1 95.19,42.08 C11.2 ; U1.10 83.06,65.94 83.41,65.58 90.12,65.58 90.99,64.71 R6.2 91.32,62.76 v1(91.64,62.76)
  Bottom Layer w0.254: v1(91.64,62.76) 95.81,62.76 96.8,61.77 v1(96.8,42.11)
$1N1213: length 7.2
  Top Layer w0.381: U4.8 39.32,76.96 38.84,76.48 38.84,71.73

## Copper pours and planes (outline as drawn; the poured copper is in the pictures)
+5V on Top Layer: 85.04,65.23 88.7,65.23 88.7,62.61 85.04,62.61
+5V on Top Layer: 97.33,70.43 99.26,70.43 99.26,65.53 97.33,65.53
+5V on Bottom Layer: 85.04,70.43 99.26,70.43 99.26,62.63 85.04,62.63
GND on Top Layer: -60.88,258.27 193.73,258.27 193.73,-41.15 -60.88,-41.15
GND on Bottom Layer: -48.41,272.52 140.59,272.52 140.59,-23.67 -48.41,-23.67
BAT on Top Layer: 78.82,59.87 93.9,59.87 93.9,52.73 78.82,52.73
$1N886 on Top Layer: 80.02,59.89 81.54,59.89 81.54,55.45 80.02,55.45
$1N887 on Top Layer: 81.33,60.38 89.15,60.38 89.15,57.78 81.33,57.78
$1N889 on Top Layer: 81.33,65.23 96.76,65.23 96.76,58.19 81.33,58.19

Small or netless copper shapes (teardrops, artwork), in the pictures only: 103 on Top Layer, 42 on Bottom Layer

## Text on the board
Top Silkscreen Layer: 自动控制原理综合实习 V1.0 Designed in CDUT 2026.06
